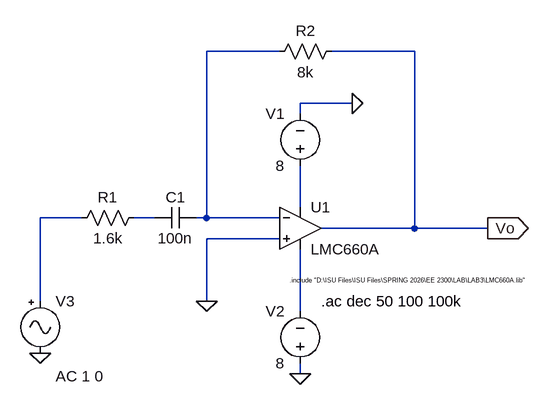
[diagram p0: schematic Exp5a.asc]
Exp5a.asc, the LTspice schematic file:
Version 4.1
SHEET 1 880 680
WIRE 176 -112 64 -112
WIRE 384 -112 256 -112
WIRE 288 -32 208 -32
WIRE 208 -16 208 -32
WIRE 208 128 208 64
WIRE -128 144 -192 144
WIRE -16 144 -48 144
WIRE 64 144 64 -112
WIRE 64 144 48 144
WIRE 176 144 64 144
WIRE 384 160 384 -112
WIRE 384 160 240 160
WIRE 496 160 384 160
WIRE 176 176 64 176
WIRE -192 272 -192 144
WIRE 64 272 64 176
WIRE 208 288 208 192
WIRE 208 384 208 368
FLAG 64 272 0
FLAG 496 160 Vo
IOPIN 496 160 Out
FLAG 208 384 0
FLAG 288 -32 0
FLAG -192 352 0
SYMBOL OpAmps\\opamp2 208 96 R0
SYMATTR InstName U1
SYMATTR Value LMC660A
SYMBOL cap 48 128 R90
WINDOW 0 0 32 VBottom 2
WINDOW 3 32 32 VTop 2
SYMATTR InstName C1
SYMATTR Value 100n
SYMBOL res -32 128 R90
WINDOW 0 0 56 VBottom 2
WINDOW 3 32 56 VTop 2
SYMATTR InstName R1
SYMATTR Value 1.6k
SYMBOL res 272 -128 R90
WINDOW 0 0 56 VBottom 2
WINDOW 3 32 56 VTop 2
SYMATTR InstName R2
SYMATTR Value 8k
SYMBOL voltage 208 80 R180
WINDOW 0 24 96 Left 2
WINDOW 3 24 16 Left 2
WINDOW 123 0 0 Left 0
WINDOW 39 0 0 Left 0
SYMATTR InstName V1
SYMATTR Value 8
SYMBOL voltage 208 384 R180
WINDOW 0 24 96 Left 2
WINDOW 3 24 16 Left 2
WINDOW 123 0 0 Left 0
WINDOW 39 0 0 Left 0
SYMATTR InstName V2
SYMATTR Value 8
SYMBOL Misc\\signal -192 256 R0
WINDOW 123 24 132 Left 2
WINDOW 39 0 0 Left 0
SYMATTR InstName V3
SYMATTR Value ""
SYMATTR Value2 AC 1 0
TEXT 192 240 Left 0 !.include "D:\\ISU Files\\ISU Files\\SPRING 2026\\EE 2300\\LAB\\LAB3\\LMC660A.lib"
TEXT 240 272 Left 2 !.ac dec 50 100 100k

The netlist it stands for:
* Exp5a.asc
X§U1 0 N001 N002 N005 Vo LMC660A  ; pins In+ In- V+ V- OUT
C1 N001 N004 100n
R1 N004 N003 1.6k
R2 Vo N001 8k
V1 N002 0 8
V2 0 N005 8
V3 N003 0 AC 1 0
.include "D:\ISU Files\ISU Files\SPRING 2026\EE 2300\LAB\LAB3\LMC660A.lib"
.ac dec 50 100 100k
.backanno
.end